# Altium schematic sheet PartsTemplate.SchDoc
size A4
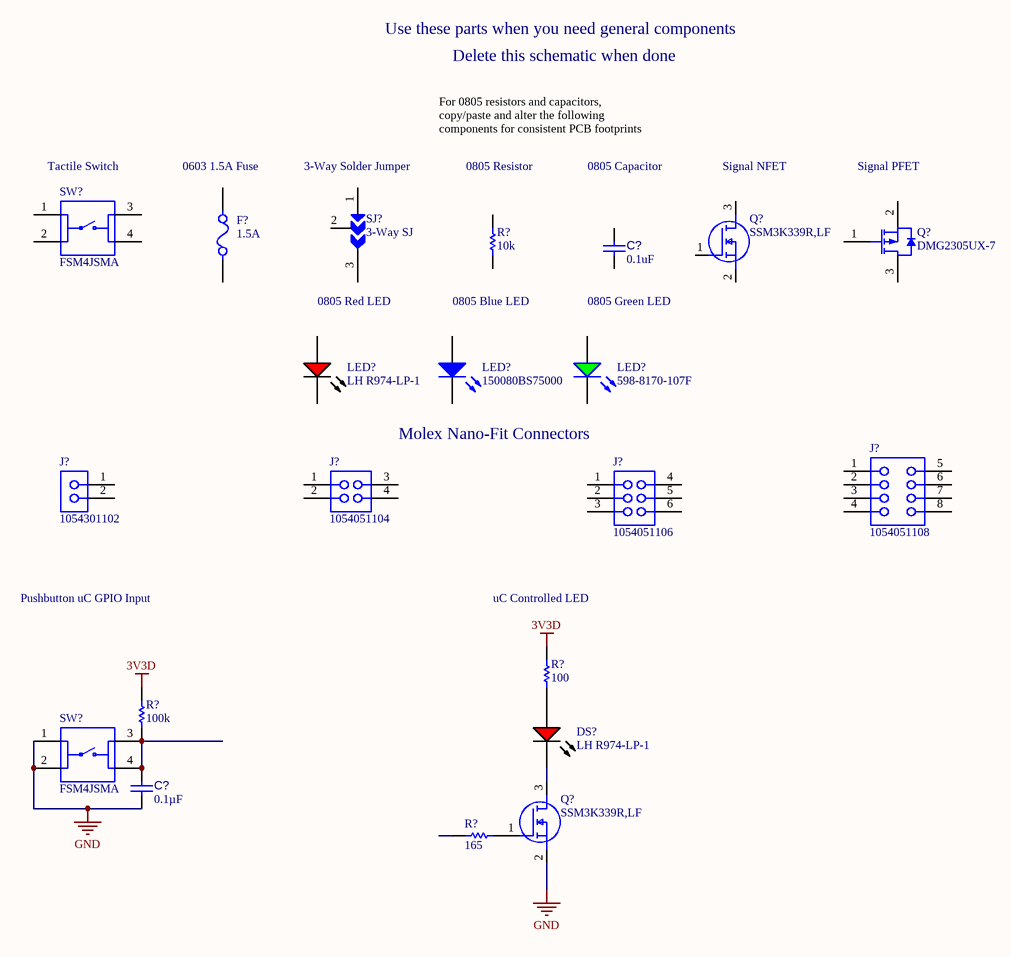
[diagram p0: PartsTemplate.SchDoc]

## Parts
(Parts that share a designator on the sheet are numbered #1, #2 ... from top to bottom, then left to right.)
C?#1  0.1uF  [CAPC2013X145X50ML20T25]
C?#2  0.1µF  [CAPC2013X145X50ML20T25]
DS?  LH R974-LP-1  [OSRM-LH R974_V]
F?  1.5A  [FUSC1608X43N]
J?#1  1054301102  [1054301102]
J?#2  1054051104  [1054051104]
J?#3  1054051106  [1054051106]
J?#4  1054051108  [1054051108]
LED?#1  LH R974-LP-1  [0805_A]
LED?#2  150080BS75000  [0805_A]
LED?#3  598-8170-107F  [0805_A]
Q?#1  DMG2305UX-7  [DIOD-SOT23-3_A_V]
Q?#2  SSM3K339R,LF  [SOTFL95P240X88-3N]
Q?#3  SSM3K339R,LF  [SOTFL95P240X88-3N]
R?#1  10k  [RESC2013X50X35ML15T15]
R?#2  100  [RESC2013X50X35ML15T15]
R?#3  100k  [RESC2013X50X35ML15T15]
R?#4  165  [RESC2013X50X35ML15T15]
SJ?  3-Way SJ  [3-Way SJ]
SW?#1  FSM4JSMA  [TE_FSM4JSMA]
SW?#2  FSM4JSMA  [TE_FSM4JSMA]

## Nets
3V3D: R?#2.2 R?#3.2
GND: C?#2.1 Q?#3.2(S) SW?#2.1 SW?#2.2
NetC?#2_2: C?#2.2 R?#3.1 SW?#2.3 SW?#2.4
NetDS?_1: DS?.1(A) R?#2.1
NetDS?_2: DS?.2(K) Q?#3.3(D)
NetQ?#3_1: Q?#3.1(G) R?#4.2

Not connected (* = marked no-connect by the designer): C?#1 1 2; F? 1 2; J?#1 1 2; J?#2 1 2 3 4; J?#3 1 2 3 4 5 6; J?#4 1 2 3 4 5 6 7 8; LED?#1 1(K) 2(A); LED?#2 1(K) 2(A); LED?#3 1(K) 2(A); Q?#1 1(GATE) 2(SOURCE) 3(DRAIN); Q?#2 1(G) 2(S) 3(D); R?#1 1 2; R?#4 1; SJ? 1 2 3; SW?#1 1 2 3 4

## Notes on the sheet
- Use these parts when you need general components
- Delete this schematic when done
- For 0805 resistors and capacitors, copy/paste and alter the following components for consistent PCB footprints
- (near SW?#1) Tactile Switch
- (near F?) 0603 1.5A Fuse
- (near SJ?) 3-Way Solder Jumper
- 0805 Resistor
- 0805 Capacitor
- (near Q?#2) Signal NFET
- Signal PFET
- 0805 Red LED
- 0805 Blue LED
- 0805 Green LED
- Molex Nano-Fit Connectors
- Pushbutton uC GPIO Input
- uC Controlled LED

## Library data of the parts
C?#1 = CMP-001-00010-4: Chip Capacitor, 0.1 uF, +/-10%, 25 V, 0805 (2012 Metric); Value: 0.1uF
C?#2 = CMP-001-00010-4: Chip Capacitor, 0.1 uF, +/-10%, 25 V, 0805 (2012 Metric); Manufacturer: KEMET; Manufacturer Part Number: C0805C104K3RACTU; Dielectric Material: Ceramic; Tolerance: 10%; Capacitance: 100nF; Dielectric: X7R; Voltage: 25V; Value: 0.1µF; Supplier 1: Digi-Key; Supplier Part Number 1: 399-1168-1-ND; RoHS: Yes; Category: Ceramic Capacitors; Stock 1: 417116; Pricing 1: 1=0.14000, 10=0.10000, 50=0.05660, 100=0.04680, 500=0.03284, 1000=0.02719 (USD); Mount: Surface Mount; Case/Package: 0805; Min Operating Temperature: -55°C; Max Operating Temperature: 125°C; Packaging: Tape and Reel; Termination: SMD/SMT; Length: 2mm; Height: 0.9mm; Depth: 1.25mm; Radiation Hardening: No; ComponentLink1URL: https://datasheet.ciiva.com/18193/getdatasheetpartid-385649-18193413.pdf?src-supplier=Verical; ComponentLink1Description: https://datasheet.ciiva.com/18193/getdatasheetpartid-385649-18193413.pdf?src-supplier=Verical; ComponentLink2URL: https://datasheet.ciiva.com/7842/kem-c1002-x7r-smd-7842536.pdf?src-supplier=Element14; ComponentLink2Description: https://datasheet.ciiva.com/7842/kem-c1002-x7r-smd-7842536.pdf?src-supplier=Element14; ComponentLink3URL: https://datasheet.ciiva.com/7842/kem-c1002-x7r-smd-7842538.pdf?src-supplier=Element14; ComponentLink3Description: https://datasheet.ciiva.com/7842/kem-c1002-x7r-smd-7842538.pdf?src-supplier=Element14
DS? = CMP-2000-06540-1: LED Uni-Color Red, 1.8 V, -30 to 85 degC, 2-Pin SMD, RoHS, Tape and Reel; Manufacturer: OSRAM; Dominant Wave Length: 645nm; Peak Wavelength: 660nm; Chip Material: GaAlAs; Main Category: ChipLED; Luminous Intensity: 71mcd; Rad Hardened: No; Product Depth (mm): 1.35mm; Test Current (It): 20mA; Lens Type: ColorlessDiffused; Forward Current: 30mA; Viewing Angle: 160deg; Product Length (mm): 2.1mm; Reverse Voltage: 5V; Number of  Elements: 1; Luminous Flux: 0.17lm; Shape Type: Rectangular; Product Height (mm): 0.9mm; Forward Voltage: 2.6V; Package Description: 2-Pin Surface Mount Device, Body 1.25 x 2 mm; Operating Temperature Classification: Commercial; Emitting Color: Red; Pin Count: 2; Type: Uni-Color; Packaging: TapeandReel; High Brightness: No; Datasheet URL: https://datasheet.ciiva.com/26941/getdatasheetpartid-258950-26941914.pdf; Operating Temp Range: -30Cto85C; Lens Dimensions: 1.4x1.35x0.5mm; Package Type: ChipLed; Datasheet Version: Rev. 1.0, 11/2012; Mounting Technology: SurfaceMount; Manufacturer URL: https://www.osram.com/corporate/; Package Reference: LH R974; Mounting: SurfaceMount
F? = 046701.5NR: 1.5A 0603 Fuse; Manufacturer_Name: LITTELFUSE; Datasheet Link: https://www.littelfuse.com/~/media/electronics/datasheets/fuses/littelfuse_fuse_467_datasheet.pdf.pdf; Height: 0.432mm; Manufacturer_Part_Number: 046701.5NR; Arrow Part Number: 046701.5NR; Arrow Price/Stock: https://www.arrow.com/en/products/046701.5nr/littelfuse; Mouser Part Number: 576-046701.5NR; Mouser Price/Stock: https://www.mouser.com/Search/Refine.aspx?Keyword=576-046701.5NR; Value: 1.5A
J?#1 = 1054301102: Nano-Fit Right-Angle Header, Surface Mount, 2.50mm Pitch, Single Row, 2 Circuits, 0.76µm Tin (Sn) Plating, Black, Glow-Wire Capable; Manufacturer: Molex; Pitch: 2.5 mm; Part Number: 1054301102; ComponentLink2Description: Datasheet; Mounting Technology: Surface Mount; ComponentLink2URL: https://www.molex.com/webdocs/datasheets/pdf/en-us/1054301102_PCB_HEADERS.pdf; Orientation: Right
J?#2 = 1054051104: Nano-Fit Right-Angle Header, Surface Mount, 2.50mm Pitch, Dual Row, 4 Circuits, 0.76µm Tin (Sn) Plating, Black, Glow-Wire Capable; Manufacturer: Molex; Pitch: 2.5 mm; Part Number: 1054051104; ComponentLink2Description: Datasheet; Mounting Technology: Surface Mount; ComponentLink2URL: https://www.molex.com/webdocs/datasheets/pdf/en-us/1054051104_PCB_HEADERS.pdf; Orientation: Right
J?#3 = 1054051106: Nano-Fit Right-Angle Header, Surface Mount, 2.50mm Pitch, Dual Row, 6 Circuits, 0.76µm Tin (Sn) Plating, Black, Glow-Wire Capable; Manufacturer: Molex; Pitch: 2.5 mm; Part Number: 1054051106; ComponentLink2Description: Datasheet; Mounting Technology: Surface Mount; ComponentLink2URL: https://www.molex.com/webdocs/datasheets/pdf/en-us/1054051106_PCB_HEADERS.pdf; Orientation: Right
J?#4 = 1054051108: Nano-Fit Right-Angle Header, Surface Mount, 2.50mm Pitch, Dual Row, 8 Circuits, 0.76µm Tin (Sn) Plating, Black, Glow-Wire Capable; Manufacturer: Molex; Part Number: 1053141108; Pitch: 2.5mm; ComponentLink2URL: https://www.molex.com/webdocs/datasheets/pdf/en-us/1054051108_PCB_HEADERS.pdf; ComponentLink2Description: Datasheet; Orientation: Right; Mounting Technology: Surface Mount
LED?#1 = CMP-62016-000032-1: LED RED DIFFUSED 0805 SMD; Number of Elements: 1; Forward Voltage: 2.6V; Viewing Angle: 160°; Reverse Voltage: 5V; Test Current: 20mA; Dominant Wavelength: 645nm; Forward Current: 30mA; Luminous Intensity: 15mcd; Depth: 1.35mm; Min Operating Temperature: -30°C; Length: 2.1mm; Max Operating Temperature: 85°C; Radiation Hardening: No; Packaging: Tape and Reel; Number of Pins: 2; Mount: Surface Mount; Lens Style: Diffused
LED?#2 = CMP-1426-00008-1: SMD mono-color Chip LED, WL-SMCW, Blue; Manufacturer: Wuerth Elektronik; Color: Blue; ComponentLink2URL: http://katalog.we-online.com/led/datasheet/150080BS75000.pdf; ComponentLink1URL: http://www.we-online.com; ComponentLink2Description: Datasheet; PackageReference: 0805_A; ComponentLink1Description: Manufacturer URL; PartNumber: 150080BS75000
LED?#3 = CMP-2000-05655-1: Single Color, 2 V, -30 to 85 degC, 2-Pin SMD (0805), RoHS, Tape and Reel; Manufacturer: Dialight; Main Category: ChipLED; Shape Type: Rectangular; Forward Current: 25mA; Product Length (mm): 2mm; Emitting Color: YellowGreen; Test Current (It): 20mA; Number of  Elements: 1; Luminous Intensity: 20mcd; DELETED: Compliant; Reverse Voltage: 5V; Chip Material: GaP; High Brightness: No; Viewing Angle: 140deg; Dominant Wave Length: 570nm; Type: Uni-Color; Product Depth (mm): 1.25mm; Power Dissipation: 60W; Product Height (mm): 0.7mm; Forward Voltage: 2.4V; Lens Dimensions: 1.4x1.25x0.4mm; Pin Count: 2; Datasheet URL: https://datasheet.ciiva.com/22748/1484480-22748121.pdf; Operating Temperature Classification: Commercial; Package Reference: 0805; Operating Temp Range: -30Cto85C; Mounting: SurfaceMount; Mounting Technology: SurfaceMount; Manufacturer URL: http://www.dialight.com/; Package Description: 2-Pin Surface Mount Device, Body 2 x 1.25 mm; Lum Intensity: 20mcd; Datasheet Version: 10/2008; Rad Hardened: No; Packaging: TapeandReel; Package Type: SMD
Q?#1 = CMP-1693-00002-3: P-Channel Enhancement Mode MOSFET, 20 V, -55 to 150 degC, 3-Pin SOT23, RoHS, Tape and Reel; RoHSCompliant: True; Pins: 3; PackageDescription: 3-Pin Small Outline Transistor, Body 2.9 x 1.3 mm, Pitch 0.915 mm; Min Operating Temperature: -55 degC; Mounting Technology: Surface Mount; ComponentLink2URL: http://www.diodes.com/_files/datasheets/DMG2305UX.pdf; PartNumber: DMG2305UX-7; ComponentLink1URL: http://www.diodes.com/; DatasheetVersion: Rev. 5-2; Max Operating Temperature: 150 degC; Packaging: Tape and Reel; Radiation Hardening: No; ComponentLink1Description: Manufacturer URL; Case/Package: TO-236-3; ComponentLink2Description: Datasheet; Package Quantity: 1; Mount: Surface Mount
Q?#2 Q?#3 = SSM3K339R,LF: MOSFET (N-Channel); Manufacturer_Name: Toshiba; Datasheet Link: https://www.arrow.com/en/products/ssm3k339rlf/toshiba; Height: 0.88mm; Manufacturer_Part_Number: SSM3K339R,LF; Arrow Part Number: SSM3K339R,LF; Arrow Price/Stock: https://www.arrow.com/en/products/ssm3k339rlf/toshiba; Mouser Part Number: 757-SSM3K339RLF; Mouser Price/Stock: https://www.mouser.co.uk/ProductDetail/Toshiba/SSM3K339RLF?qs=vPP9GyyTAo2h4IM%252B%252BLvR%252BA%3D%3D
R?#1 = CMP-009-00001-4: Chip Resistor, 10k Ohm, +/- 1%, 125 mW, -55 to 155 degC, 0805 (2012 Metric); Value: 10k
R?#2 = CMP-009-00001-4: Chip Resistor, 100 Ohm, +/- 1%, 125 mW, -55 to 155 degC, 0805 (2012 Metric); Manufacturer: Panasonic; Manufacturer Part Number: ERA-6AEB101V; Tolerance: 0.1%; Resistance: 100R; Temperature Coefficient: 25ppm/°C; Power Rating: 125mW; Voltage Rating: 100V; Value: 100; Supplier 1: Digi-Key; Supplier Part Number 1: P100DACT-ND; RoHS: Yes; Category: Chip SMD Resistors; Stock 1: 127229; Pricing 1: 1=0.33000, 10=0.27800, 100=0.10850, 1000=0.04541, 2500=0.04163 (USD); Mount: Surface Mount; Case/Package: 0805; Number of Pins: 2; Contact Plating: Tin; Case Code (Imperial): 0805; Case Code (Metric): 2012; Min Operating Temperature: -55°C; Max Operating Temperature: 155°C; Composition: Metal Film,Thin Film; Packaging: Tape and Reel; Package Quantity: 1; Termination: SMD/SMT; Number of Terminations: 2; Military Standard: Not; Max Power Dissipation: 125mW; Voltage Rating (DC): 100V; Features: Automotive AEC-Q200; Length: 2mm; Height: 0.5mm; Width: 1.25mm; Depth: 1.25mm; Radiation Hardening: No; REACH SVHC: No SVHC; Lead Free: Lead Free; ComponentLink1URL: https://datasheet.ciiva.com/11810/0900766b80beefcc-11810733.pdf?src-supplier=RSComponents; ComponentLink1Description: https://datasheet.ciiva.com/11810/0900766b80beefcc-11810733.pdf?src-supplier=RSComponents; ComponentLink2URL: https://datasheet.ciiva.com/29184/452698-da-01-en-widerstand-0805-era-29184051.pdf?src-supplier=Conrad; ComponentLink2Description: https://datasheet.ciiva.com/29184/452698-da-01-en-widerstand-0805-era-29184051.pdf?src-supplier=Conrad; ComponentLink3URL: https://datasheet.ciiva.com/16774/70068849-16774677.pdf?src-supplier=Allied+Electronics; ComponentLink3Description: https://datasheet.ciiva.com/16774/70068849-16774677.pdf?src-supplier=Allied+Electronics; ComponentLink4URL: https://datasheet.ciiva.com/22758/485442-22758149.pdf?src-supplier=Farnell; ComponentLink4Description: https://datasheet.ciiva.com/22758/485442-22758149.pdf?src-supplier=Farnell; ComponentLink5URL: https://datasheet.ciiva.com/46438/485442-46438213.pdf?src-supplier=Element14; ComponentLink5Description: https://datasheet.ciiva.com/46438/485442-46438213.pdf?src-supplier=Element14; ComponentLink6URL: https://datasheet.ciiva.com/16770/70068849-16770007.pdf?src-supplier=Allied+Electronics; ComponentLink6Description: https://datasheet.ciiva.com/16770/70068849-16770007.pdf?src-supplier=Allied+Electronics; ComponentLink7URL: https://datasheet.ciiva.com/46438/485442-46438214.pdf?src-supplier=Element14; ComponentLink7Description: https://datasheet.ciiva.com/46438/485442-46438214.pdf?src-supplier=Element14; ComponentLink8URL: https://datasheet.ciiva.com/30140/54aoa0000ce26-30140696.pdf?src-supplier=Onlinecomponents.com; ComponentLink8Description: https://datasheet.ciiva.com/30140/54aoa0000ce26-30140696.pdf?src-supplier=Onlinecomponents.com; ComponentLink9URL: https://datasheet.ciiva.com/17207/aoa0000ce26-17207961.pdf?src-supplier=Avnet+Europe; ComponentLink9Description: https://datasheet.ciiva.com/17207/aoa0000ce26-17207961.pdf?src-supplier=Avnet+Europe; ComponentLink10URL: https://datasheet.ciiva.com/24072/aoa0000ce26-32660-24072217.pdf?src-supplier=Mouser; ComponentLink10Description: https://datasheet.ciiva.com/24072/aoa0000ce26-32660-24072217.pdf?src-supplier=Mouser; ComponentLink11URL: https://datasheet.ciiva.com/28513/485442-28513850.pdf?src-supplier=Element14; ComponentLink11Description: https://datasheet.ciiva.com/28513/485442-28513850.pdf?src-supplier=Element14; ComponentLink12URL: https://datasheet.ciiva.com/48536/era-eng-tds-48536747.pdf?src-supplier=Distrelec; ComponentLink12Description: https://datasheet.ciiva.com/48536/era-eng-tds-48536747.pdf?src-supplier=Distrelec; ComponentLink13URL: https://datasheet.ciiva.com/16396/aoa0000ce26-16396828.pdf?src-supplier=Future+Electronics; ComponentLink13Description: https://datasheet.ciiva.com/16396/aoa0000ce26-16396828.pdf?src-supplier=Future+Electronics; ComponentLink14URL: https://datasheet.ciiva.com/9186/aoa0000ce26-9186749.pdf?src-supplier=Avnet; ComponentLink14Description: https://datasheet.ciiva.com/9186/aoa0000ce26-9186749.pdf?src-supplier=Avnet
R?#3 = CMP-009-00001-4: Chip Resistor, 100k Ohm, +/- 1%, 125 mW, -55 to 155 degC, 0805 (2012 Metric); Manufacturer: Yageo; Manufacturer Part Number: RC0805FR-07100KL; Resistance: 100kR; Voltage Rating (DC): 150V; Temperature Coefficient: 100ppm/°C; Power Rating: 125mW; Value: 100k; Supplier 1: Digi-Key; Supplier Part Number 1: 311-100KCRCT-ND; RoHS: Yes; Category: Chip SMD Resistors; Stock 1: 3716407; Pricing 1: 1=0.10000, 10=0.03900, 100=0.01570, 1000=0.00705, 2500=0.00612 (USD); Case/Package: 0805; Number of Pins: 2; Case Code (Metric): 2012; Case Code (Imperial): 0805; Min Operating Temperature: -55°C; Max Operating Temperature: 155°C; Tolerance: 1%; Packaging: Tape and Reel; Composition: Thick Film; Voltage Rating: 150V; Package Quantity: 1; Number of Terminations: 2; Termination: SMD/SMT; Military Standard: Not; Max Power Dissipation: 125mW; Features: Moisture Resistant; Length: 2mm; Height: 0.024inch; Width: 0.049inch; Depth: 1.25mm; Lead Pitch: 0.4mm; REACH SVHC: Unknown; Lead Free: Lead Free; ComponentLink1URL: https://datasheet.ciiva.com/11808/0900766b8106beab-11808858.pdf?src-supplier=RSComponents; ComponentLink1Description: https://datasheet.ciiva.com/11808/0900766b8106beab-11808858.pdf?src-supplier=RSComponents; ComponentLink2URL: https://datasheet.ciiva.com/2457/pyu-r-int-thick-7-2457017.pdf?src-supplier=Digi-Key; ComponentLink2Description: https://datasheet.ciiva.com/2457/pyu-r-int-thick-7-2457017.pdf?src-supplier=Digi-Key; ComponentLink3URL: https://datasheet.ciiva.com/12667/rc0805-12667001.pdf?src-supplier=Mouser; ComponentLink3Description: https://datasheet.ciiva.com/12667/rc0805-12667001.pdf?src-supplier=Mouser; ComponentLink4URL: https://datasheet.ciiva.com/2457/pyu-r-int-thick-7-2457018.pdf?src-supplier=Digi-Key; ComponentLink4Description: https://datasheet.ciiva.com/2457/pyu-r-int-thick-7-2457018.pdf?src-supplier=Digi-Key; ComponentLink5URL: https://datasheet.ciiva.com/16747/rc0805-16747226.pdf?src-supplier=Future+Electronics; ComponentLink5Description: https://datasheet.ciiva.com/16747/rc0805-16747226.pdf?src-supplier=Future+Electronics; ComponentLink6URL: https://datasheet.ciiva.com/2457/pyu-r-int-thick-7-2457019.pdf?src-supplier=Digi-Key; ComponentLink6Description: https://datasheet.ciiva.com/2457/pyu-r-int-thick-7-2457019.pdf?src-supplier=Digi-Key; ComponentLink7URL: https://datasheet.ciiva.com/7660/38627-7660796.pdf?src-supplier=Element14; ComponentLink7Description: https://datasheet.ciiva.com/7660/38627-7660796.pdf?src-supplier=Element14; ComponentLink8URL: https://datasheet.ciiva.com/7941/1697719-7941676.pdf?src-supplier=Element14; ComponentLink8Description: https://datasheet.ciiva.com/7941/1697719-7941676.pdf?src-supplier=Element14; ComponentLink9URL: https://datasheet.ciiva.com/7941/1686128-7941677.pdf?src-supplier=Element14; ComponentLink9Description: https://datasheet.ciiva.com/7941/1686128-7941677.pdf?src-supplier=Element14; ComponentLink10URL: https://datasheet.ciiva.com/7941/1697719-7941678.pdf?src-supplier=Element14; ComponentLink10Description: https://datasheet.ciiva.com/7941/1697719-7941678.pdf?src-supplier=Element14; ComponentLink11URL: https://datasheet.ciiva.com/22747/444164-22747534.pdf?src-supplier=Element14; ComponentLink11Description: https://datasheet.ciiva.com/22747/444164-22747534.pdf?src-supplier=Element14
R?#4 = CMP-009-00001-4: Chip Resistor, 165 Ohm, +/- 1%, 125 mW, -55 to 155 degC, 0805 (2012 Metric); Manufacturer: Panasonic; Manufacturer Part Number: ERA-6AEB1650V; Power Rating: 125mW; Tolerance: 0.1%; Voltage Rating: 100V; Resistance: 165R; Temperature Coefficient: 25ppm/°C; Value: 165; Supplier 1: Digi-Key; Supplier Part Number 1: P165DACT-ND; RoHS: Yes; Category: Chip SMD Resistors; Stock 1: 7632; Pricing 1: 1=0.33000, 10=0.27800, 100=0.10850, 1000=0.04541, 2500=0.04163 (USD); Mount: Surface Mount; Case/Package: 0805; Number of Pins: 2; Case Code (Imperial): 0805; Case Code (Metric): 2012; Contact Plating: Tin; Min Operating Temperature: -55°C; Max Operating Temperature: 155°C; Packaging: Tape and Reel; Composition: Metal Film,Thin Film; Features: Automotive AEC-Q200; Voltage Rating (DC): 100V; Number of Terminations: 2; Termination: Solder; Package Quantity: 1; Max Power Dissipation: 125mW; Length: 2mm; Height: 0.5mm; Width: 1.25mm; Depth: 1.25mm; Radiation Hardening: No; Lead Free: Lead Free; ComponentLink1URL: https://datasheet.ciiva.com/11815/0900766b80eb1d8c-11815736.pdf?src-supplier=RSComponents; ComponentLink1Description: https://datasheet.ciiva.com/11815/0900766b80eb1d8c-11815736.pdf?src-supplier=RSComponents; ComponentLink2URL: https://datasheet.ciiva.com/41450/001181180-da-01-en-widerstand-era-0805-165r-0-1-5000st-41450340.pdf?src-supplier=Conrad; ComponentLink2Description: https://datasheet.ciiva.com/41450/001181180-da-01-en-widerstand-era-0805-165r-0-1-5000st-41450340.pdf?src-supplier=Conrad; ComponentLink3URL: https://datasheet.ciiva.com/5950/485442-5950985.pdf?src-supplier=Farnell; ComponentLink3Description: https://datasheet.ciiva.com/5950/485442-5950985.pdf?src-supplier=Farnell; ComponentLink4URL: https://datasheet.ciiva.com/17207/aoa0000ce26-17207273.pdf?src-supplier=Avnet+Europe; ComponentLink4Description: https://datasheet.ciiva.com/17207/aoa0000ce26-17207273.pdf?src-supplier=Avnet+Europe; ComponentLink5URL: https://datasheet.ciiva.com/7942/485442-7942219.pdf?src-supplier=Element14; ComponentLink5Description: https://datasheet.ciiva.com/7942/485442-7942219.pdf?src-supplier=Element14; ComponentLink6URL: https://datasheet.ciiva.com/9185/aoa0000ce26-9185164.pdf?src-supplier=Avnet; ComponentLink6Description: https://datasheet.ciiva.com/9185/aoa0000ce26-9185164.pdf?src-supplier=Avnet; ComponentLink7URL: https://datasheet.ciiva.com/5950/485442-5950981.pdf?src-supplier=Farnell; ComponentLink7Description: https://datasheet.ciiva.com/5950/485442-5950981.pdf?src-supplier=Farnell; ComponentLink8URL: https://datasheet.ciiva.com/7942/485442-7942220.pdf?src-supplier=Element14; ComponentLink8Description: https://datasheet.ciiva.com/7942/485442-7942220.pdf?src-supplier=Element14
SJ? = 3-Way SJ: 3-Way Solder Jumper
SW?#1 SW?#2 = FSM4JSMA: Tactile Switch SPST-NO Top Actuated Surface Mount; Contact_Current_Rating: 50 mA; Configuration_Pole-Throw: Single Pole - Single Throw; MF: TE Connectivity; SnapEDA_Link: https://www.snapeda.com/parts/FSM4JSMA/TE%20Connectivity%20ALCOSWITCH%20Switches/view-part/543632/?ref=snap; Availability: Unavailable; TE_purchase_URL: https://www.te.com/usa-en/product-4-1437565-1.html?te_bu=Cor&te_type=disp&te_campaign=seda_glo_cor-seda-global-disp-prtnr-fy19-seda-model-bom-cta_sma-317_1&elqCampaignId=32493; MP: FSM4JSMA; EU_RoHS_Compliance: Compliant; Price: None; Value: *; Package: None